# Altium schematic sheet ESP32_HID.SchDoc
size A4; SheetNumber: 1; SheetTotal: 1
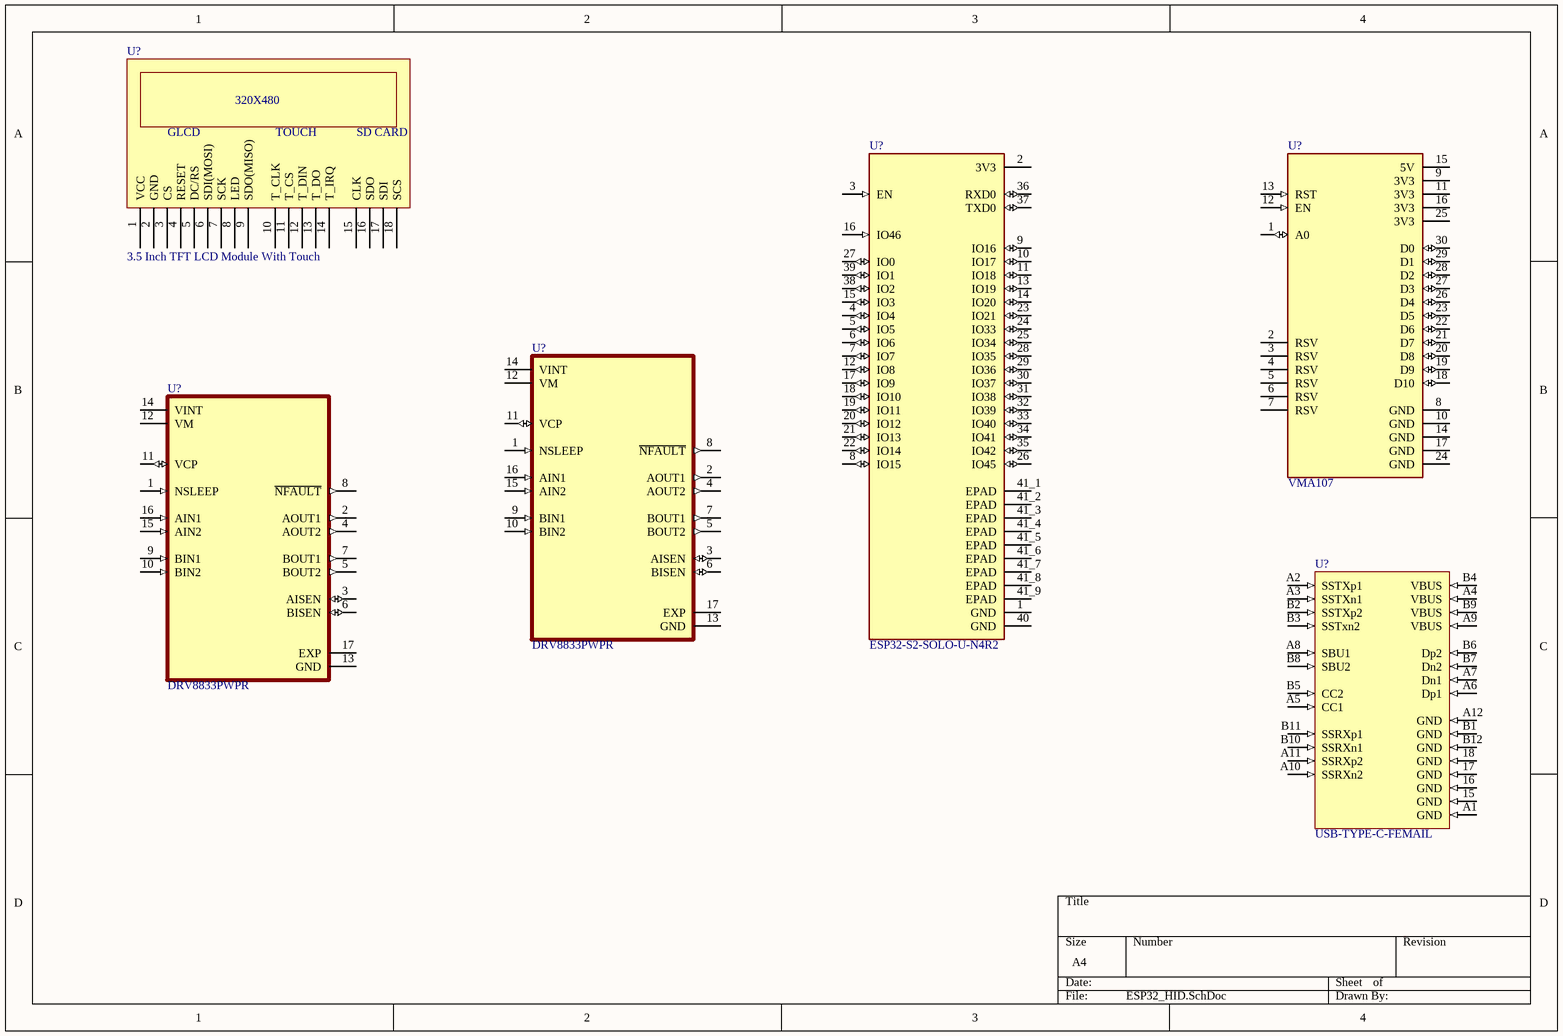
[diagram p0: ESP32_HID.SchDoc]

## Parts
(Parts that share a designator on the sheet are numbered #1, #2 ... from top to bottom, then left to right.)
U?#1  3.5 Inch TFT LCD Module With Touch  [PCBComponent_1]
U?#2  VMA107  [MODULE_VMA107]
U?#3  ESP32-S2-SOLO-U-N4R2  [XCVR_ESP32-S2-SOLO-U-N4R2]
U?#4  DRV8833PWPR  [IC_DRV8833PWPR]
U?#5  DRV8833PWPR  [IC_DRV8833PWPR]
U?#6  USB-TYPE-C-FEMAIL  [C5156605]

## Nets

Not connected (* = marked no-connect by the designer): U?#1 1(VCC) 2(GND) 3(CS) 4(RESET) 5(DC/RS) 6(SDI(MOSI)) 7(SCK) 8(LED) 9(SDO(MISO)) 10(T_CLK) 11(T_CS) 12(T_DIN) 13(T_DO) 14(T_IRQ) 15(CLK) 16(SDO) 17(SDI) 18(SCS); U?#2 1(A0) 2(RSV) 3(RSV) 4(RSV) 5(RSV) 6(RSV) 7(RSV) 8(GND) 9(3V3) 10(GND) 11(3V3) 12(EN) 13(RST) 14(GND) 15(5V) 16(3V3) 17(GND) 18(D10) 19(D9) 20(D8) 21(D7) 22(D6) 23(D5) 24(GND) 25(3V3) 26(D4) 27(D3) 28(D2) 29(D1) 30(D0); U?#3 1(GND) 2(3V3) 3(EN) 4(IO4) 5(IO5) 6(IO6) 7(IO7) 8(IO15) 9(IO16) 10(IO17) 11(IO18) 12(IO8) 13(IO19) 14(IO20) 15(IO3) 16(IO46) 17(IO9) 18(IO10) 19(IO11) 20(IO12) 21(IO13) 22(IO14) 23(IO21) 24(IO33) 25(IO34) 26(IO45) 27(IO0) 28(IO35) 29(IO36) 30(IO37) 31(IO38) 32(IO39) 33(IO40) 34(IO41) 35(IO42) 36(RXD0) 37(TXD0) 38(IO2) 39(IO1) 40(GND) 41_1(EPAD) 41_2(EPAD) 41_3(EPAD) 41_4(EPAD) 41_5(EPAD) 41_6(EPAD) 41_7(EPAD) 41_8(EPAD) 41_9(EPAD); U?#4 1(NSLEEP) 2(AOUT1) 3(AISEN) 4(AOUT2) 5(BOUT2) 6(BISEN) 7(BOUT1) 8(~{NFAULT}) 9(BIN1) 10(BIN2) 11(VCP) 12(VM) 13(GND) 14(VINT) 15(AIN2) 16(AIN1) 17(EXP); U?#5 1(NSLEEP) 2(AOUT1) 3(AISEN) 4(AOUT2) 5(BOUT2) 6(BISEN) 7(BOUT1) 8(~{NFAULT}) 9(BIN1) 10(BIN2) 11(VCP) 12(VM) 13(GND) 14(VINT) 15(AIN2) 16(AIN1) 17(EXP); U?#6 15(GND) 16(GND) 17(GND) 18(GND) A1(GND) A2(SSTXp1) A3(SSTXn1) A4(VBUS) A5(CC1) A6(Dp1) A7(Dn1) A8(SBU1) A9(VBUS) A10(SSRXn2) A11(SSRXp2) A12(GND) B1(GND) B2(SSTXp2) B3(SSTxn2) B4(VBUS) B5(CC2) B6(Dp2) B7(Dn2) B8(SBU2) B9(VBUS) B10(SSRXn1) B11(SSRXp1) B12(GND)

## Notes on the sheet
- (in symbol ILI9488) 320X480; GLCD; TOUCH; SD CARD

## Library data of the parts
U?#1 = ILI9488: ComponentLink1Description: New link; ComponentLink1URL: https://www.aliexpress.com/item/32954128438.html?spm=a2g0o.order_list.order_list_main.44.5fd61802HfjXd0
U?#2 = VMA107: NodeMCU V2 Lua Based ESP8266 Development Board; MF: {'manufacturer': u'Velleman'}; Package: None; Price: None; Value: *; MP: VMA107; Availability: Unavailable
U?#3 = ESP32-S2-SOLO-U-N4R2: MF: {'manufacturer': u'Espressif Systems'}; Package: None; Price: None; MP: ESP32-S2-SOLO-U-N4R2; Availability: Unavailable; Value: *
U?#4 U?#5 = DRV8833PWPR: 10.8-V, 2-A dual H-bridge motor driver with current regulation 16-HTSSOP -40 to 85; MF: {'manufacturer': u'Texas Instruments'}; Package: None; Price: None; MP: DRV8833PWPR; Availability: Unavailable; Value: *